# Altium schematic sheet SPres.SchDoc
size A4
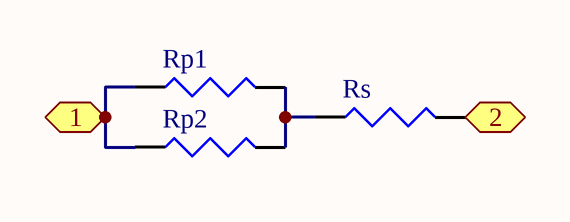
[diagram p0: SPres.SchDoc]

## Parts
Rp1  es3  [RES400]  (value not drawn)
Rp2  es3  [RES400]  (value not drawn)
Rs  es3  [RES400]  (value not drawn)

## Ports
1 (bidir), 2 (bidir)

## Nets
1: Rp1.1 Rp2.1 ; port 1
2: Rs.2 ; port 2
NetRp1_2: Rp1.2 Rp2.2 Rs.1

## Library data of the parts
Rp1 Rp2 Rs = Res3: Resistor; Published: 8-Jun-2000; LatestRevisionDate: 29-May-2009; LatestRevisionNote: IPC-7351 Footprint Added.; PackageReference: J1-0603; Publisher: Altium Limited; PackageDescription: Chip Resistor